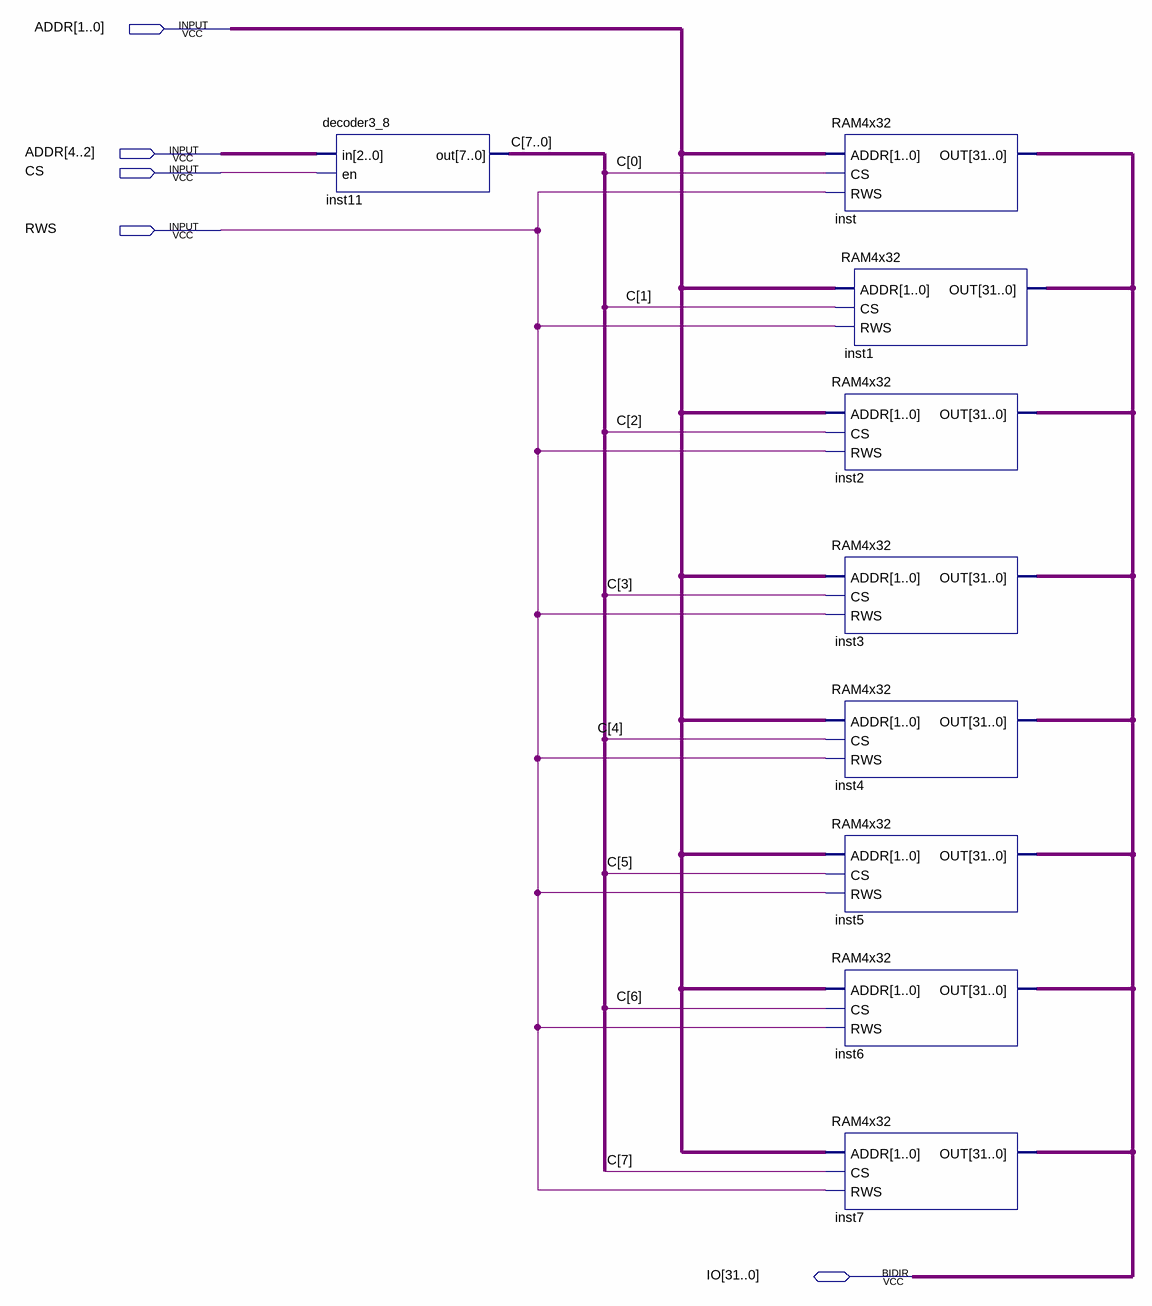
[diagram p0: schematic sheet]
// Quartus schematic RAM32x32.bdf as structural Verilog: 9 symbols, 5 pins
module RAM32x32 (
  input  [4:0] ADDR,
  input  CS,
  input  RWS,
  inout  [31:0] IO
);

  wire [7:0] C;

  decoder3_8 inst11 (.in(ADDR[4:2]), .en(CS), .out(C));
  RAM4x32 inst (.ADDR(ADDR[1:0]), .CS(C[0]), .RWS(RWS), .OUT(IO));
  RAM4x32 inst2 (.ADDR(ADDR[1:0]), .CS(C[2]), .RWS(RWS), .OUT(IO));
  RAM4x32 inst3 (.ADDR(ADDR[1:0]), .CS(C[3]), .RWS(RWS), .OUT(IO));
  RAM4x32 inst4 (.ADDR(ADDR[1:0]), .CS(C[4]), .RWS(RWS), .OUT(IO));
  RAM4x32 inst5 (.ADDR(ADDR[1:0]), .CS(C[5]), .RWS(RWS), .OUT(IO));
  RAM4x32 inst6 (.ADDR(ADDR[1:0]), .CS(C[6]), .RWS(RWS), .OUT(IO));
  RAM4x32 inst7 (.ADDR(ADDR[1:0]), .CS(C[7]), .RWS(RWS), .OUT(IO));
  RAM4x32 inst1 (.ADDR(ADDR[1:0]), .CS(C[1]), .RWS(RWS), .OUT(IO));
endmodule
